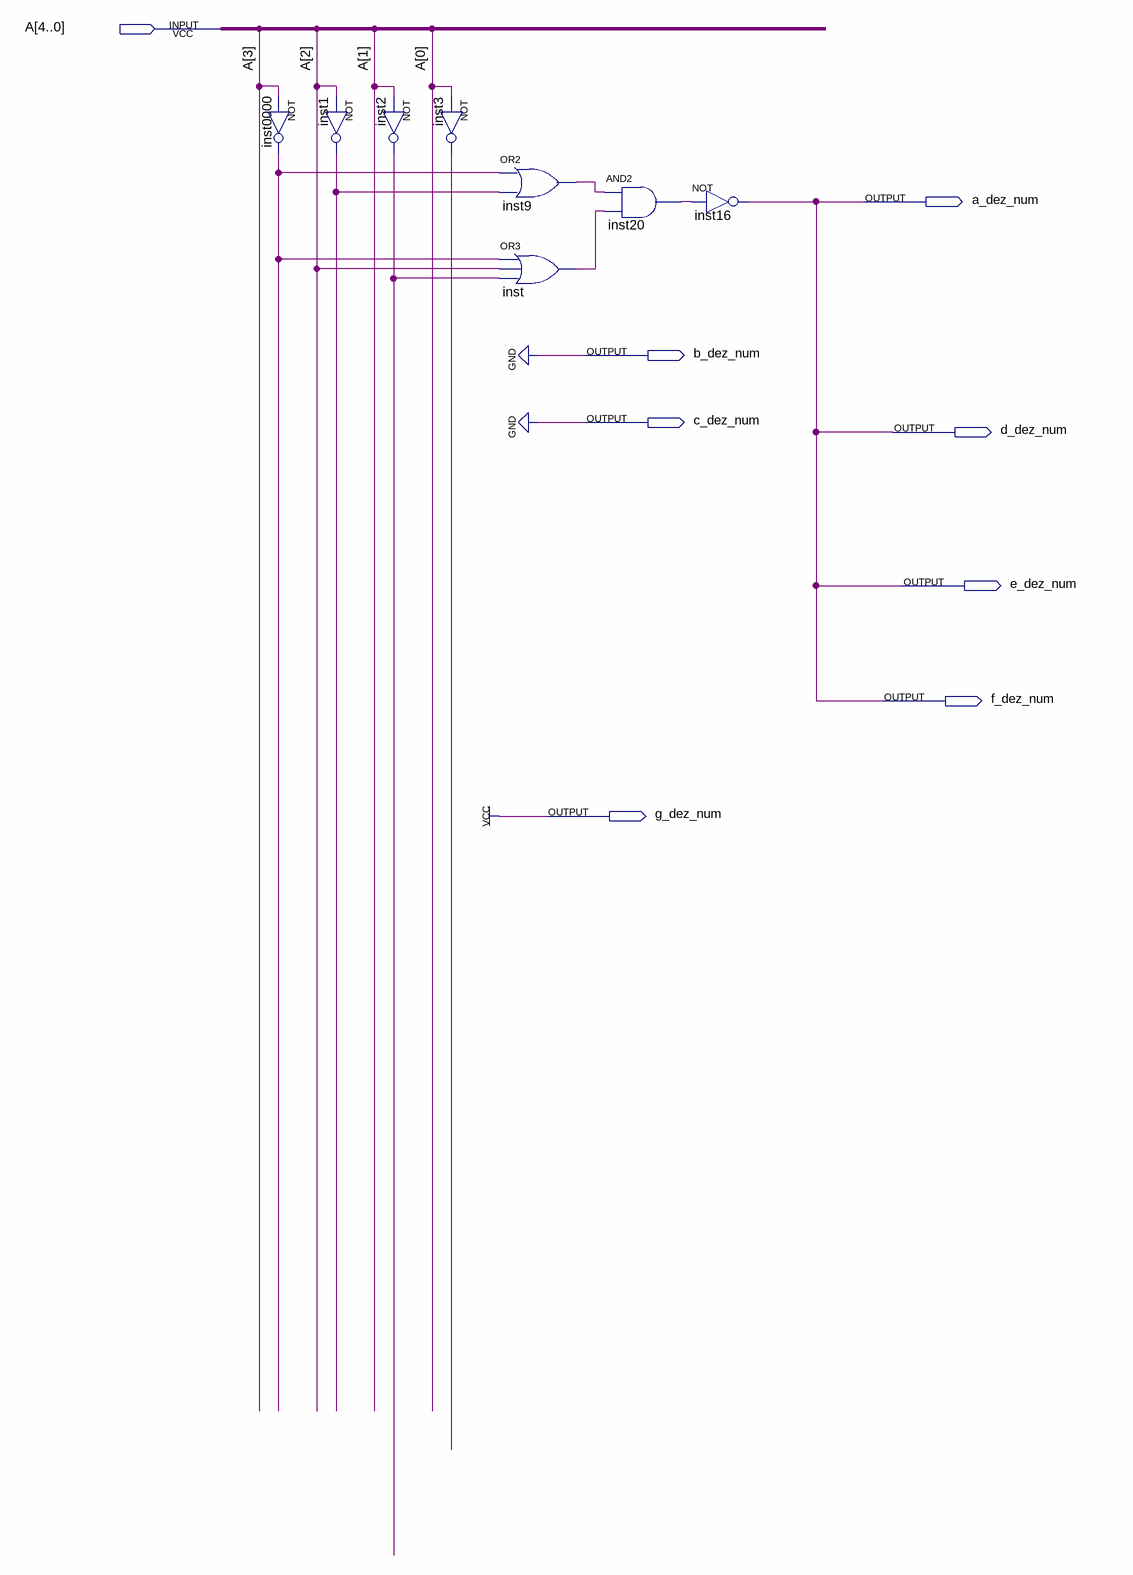
[diagram p0: schematic sheet]
// Quartus schematic Display_Dezenas_4bits.bdf as structural Verilog: 8 symbols, 8 pins
module Display_Dezenas_4bits (
  input  [4:0] A,
  output a_dez_num,
  output b_dez_num,
  output c_dez_num,
  output d_dez_num,
  output e_dez_num,
  output f_dez_num,
  output g_dez_num
);

  wire inst0000_out, inst1_out, inst2_out, inst3_out, inst9_out, inst20_out, inst_out;

  not inst1 (inst1_out, A[2]);
  not inst0000 (inst0000_out, A[3]);
  not inst2 (inst2_out, A[1]);
  not inst3 (inst3_out, A[0]);
  or inst9 (inst9_out, inst0000_out, inst1_out);
  or inst (inst_out, inst0000_out, A[2], inst2_out);
  and inst20 (inst20_out, inst9_out, inst_out);
  not inst16 (a_dez_num, inst20_out);

  assign b_dez_num = 1'b0;
  assign c_dez_num = 1'b0;
  assign d_dez_num = a_dez_num;
  assign e_dez_num = a_dez_num;
  assign f_dez_num = a_dez_num;
  assign g_dez_num = 1'b1;
endmodule
